# Altium project ART-Pi_STM32H750_COPY.PrjPcb (part 2 of 2)

## Sheet ART-Pi_Connector.SchDoc: Expansion_Conn
size A3; DocumentNumber: 10; Revision: V1.5; SheetNumber: 10; SheetTotal: 11; PageSetup: Record=PageOptions|CenterHorizontal=True|CenterVertical=True|PrintScale=1.01|XCorrection=1.00|YCorrection=1.00|PrintKind=0|BorderSize=5000000|LeftOffset=0|BottomOffset=0|Orientation=2|PaperLength=1000|PaperWidth=1000|Scale=100|PaperSource=7|PrintQuality=600|MediaType=1|DitherType=10|PrintScaleMode=1|PaperKind=A3(297x420mm)|PaperIndex=8
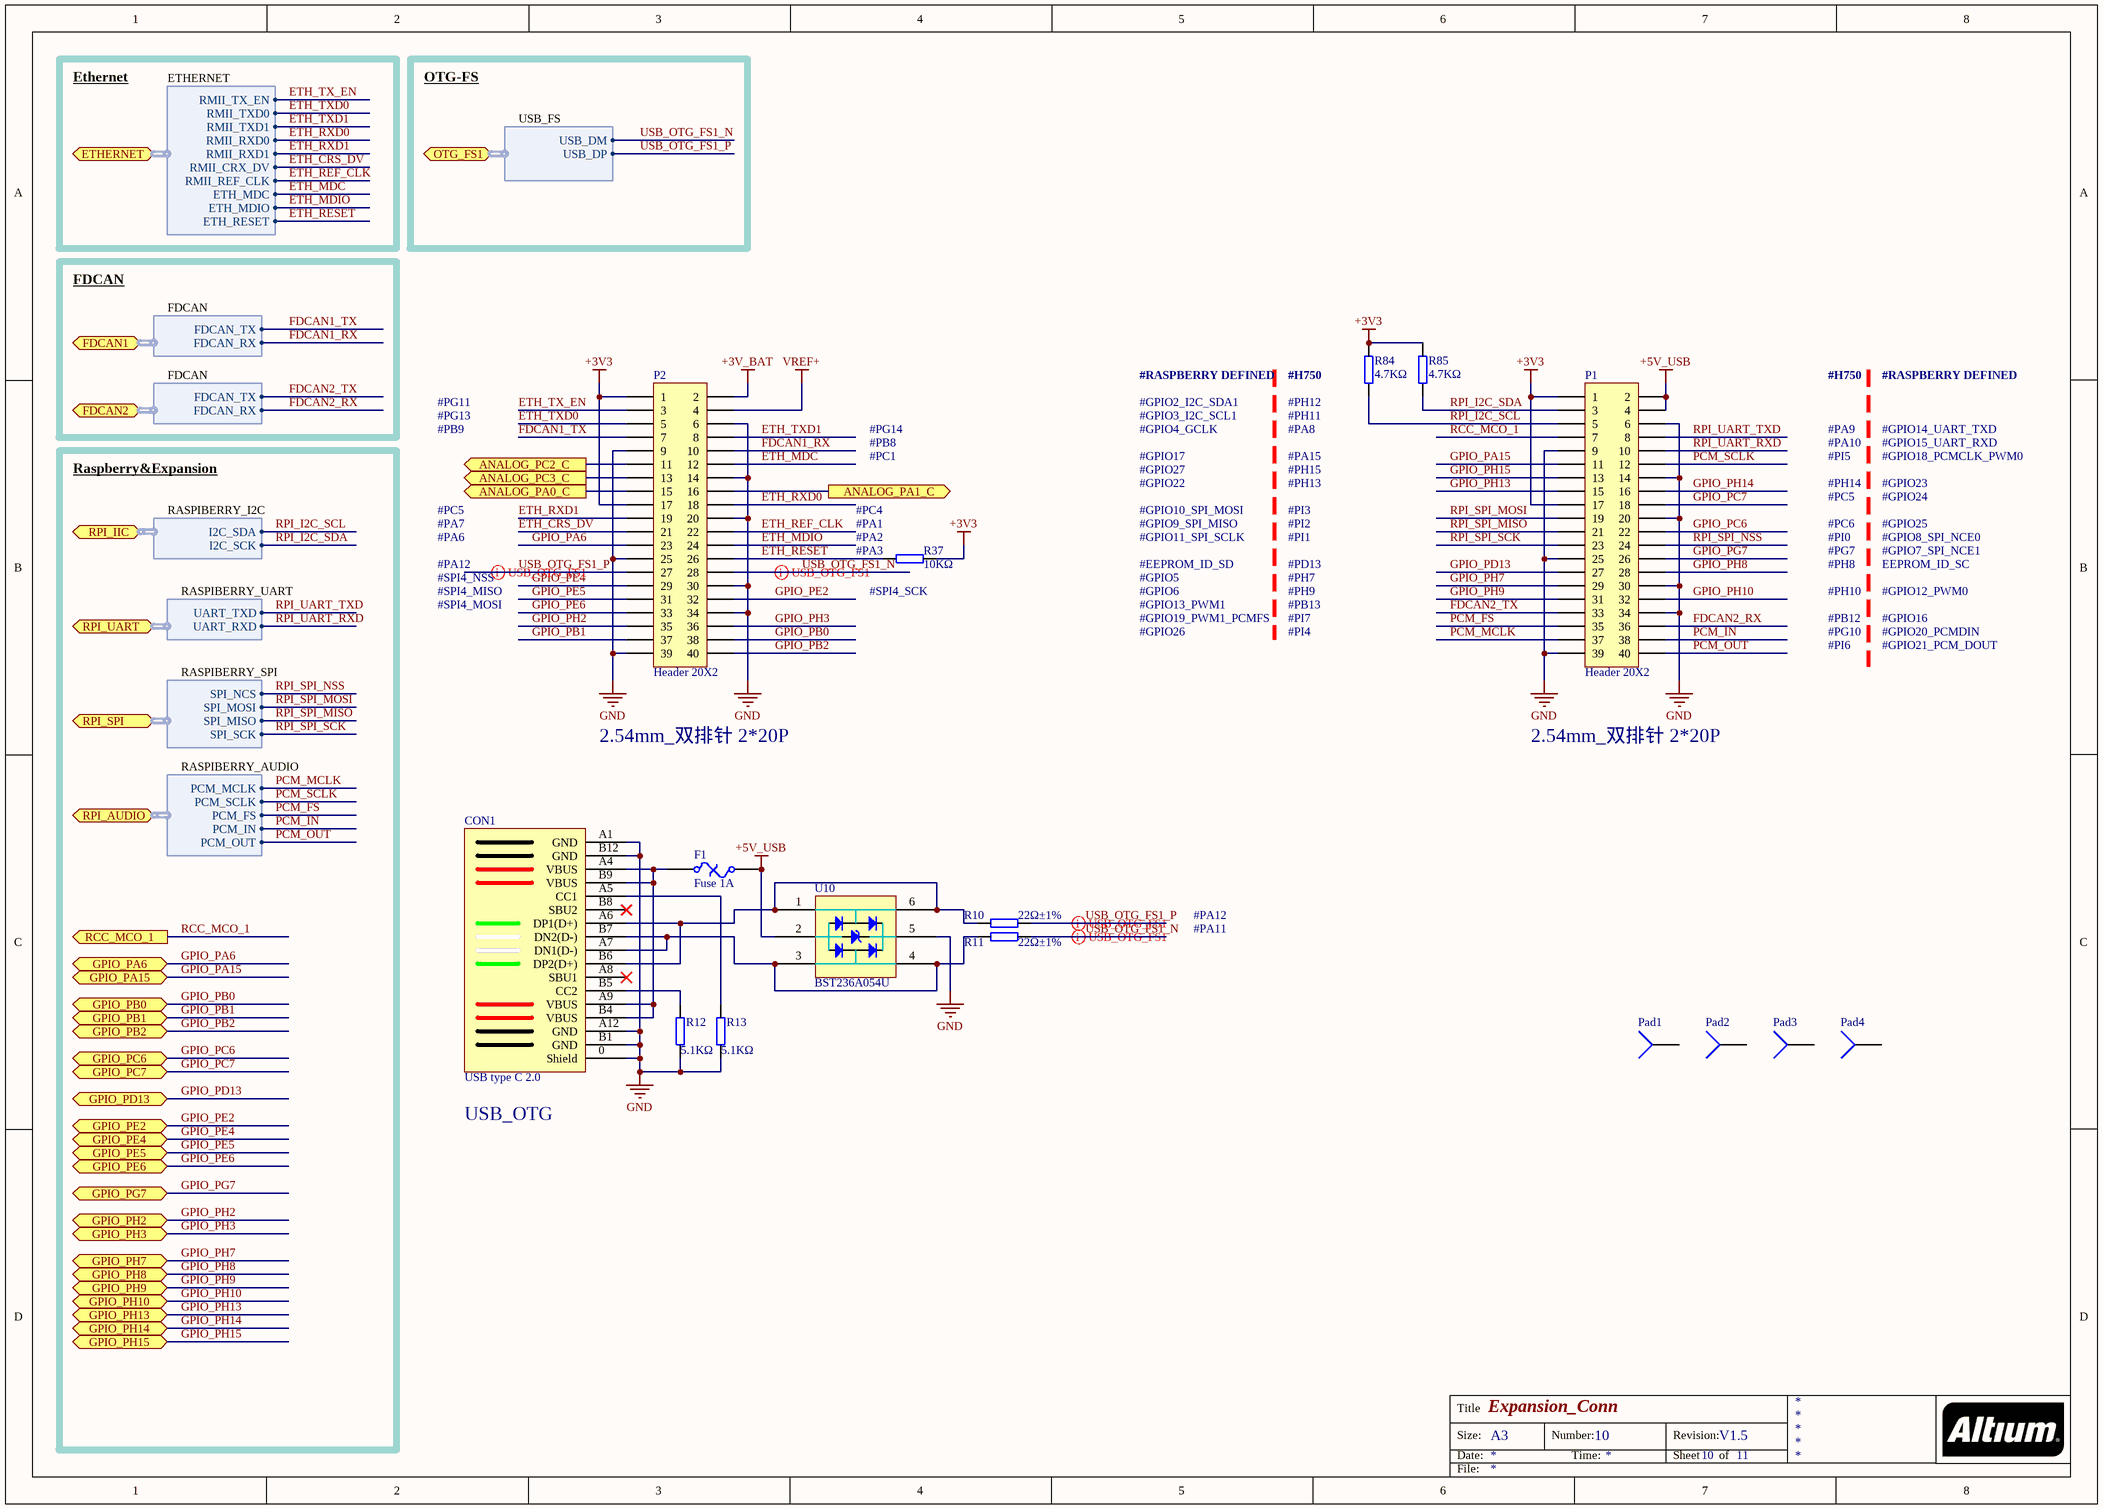
[diagram p8: ART-Pi_Connector.SchDoc]

### Parts
CON1  USB type C 2.0  [USB_C]
F1  Fuse 1A  [0805_R]
P1  Header 20X2  [HDR2X20]
P2  Header 20X2  [HDR2X20]
Pad1  Socket  [Pad-3mm]  (value not drawn)
Pad2  Socket  [Pad-3mm]  (value not drawn)
Pad3  Socket  [Pad-3mm]  (value not drawn)
Pad4  Socket  [Pad-3mm]  (value not drawn)
R10  22Ω±1%  [0402_R]
R11  22Ω±1%  [0402_R]
R12  5.1KΩ  [0402_R]
R13  5.1KΩ  [0402_R]
R37  10KΩ  [0402_R]
R84  4.7KΩ  [0402_R]
R85  4.7KΩ  [0402_R]
U10  BST236A054U  [SOT23_6]

### Ports
ANALOG_PA0_C (out), ANALOG_PA1_C (out), ANALOG_PC2_C (out), ANALOG_PC3_C (out), ETHERNET (harness Harness), FDCAN1 (harness Harness), FDCAN2 (harness Harness), GPIO_PA6 (bidir), GPIO_PA15 (bidir), GPIO_PB0 (bidir), GPIO_PB1 (bidir), GPIO_PB2 (bidir), GPIO_PC6 (bidir), GPIO_PC7 (bidir), GPIO_PD13 (bidir), GPIO_PE2 (bidir), GPIO_PE4 (bidir), GPIO_PE5 (bidir), GPIO_PE6 (bidir), GPIO_PG7 (bidir), GPIO_PH2 (bidir), GPIO_PH3 (bidir), GPIO_PH7 (bidir), GPIO_PH8 (bidir), GPIO_PH9 (bidir), GPIO_PH10 (bidir), GPIO_PH13 (bidir), GPIO_PH14 (bidir), GPIO_PH15 (bidir), OTG_FS1 (harness Harness), RCC_MCO_1 (out), RPI_AUDIO (harness Harness), RPI_IIC (harness Harness), RPI_SPI (harness Harness), RPI_UART (harness Harness)

### Harnesses
Harness: USB_DM, USB_DP
Harness: FDCAN_TX, FDCAN_RX
Harness: UART_TXD, UART_RXD
Harness: SPI_NCS, SPI_MOSI, SPI_MISO, SPI_SCK
Harness: PCM_MCLK, PCM_SCLK, PCM_FS, PCM_IN, PCM_OUT
Harness: RMII_TX_EN, RMII_TXD0, RMII_TXD1, RMII_RXD0, RMII_RXD1, RMII_CRX_DV, RMII_REF_CLK, ETH_MDC, ETH_MDIO, ETH_RESET
Harness: I2C_SCK, I2C_SDA

### Nets
+3V3: P1.1 P1.17 P2.1 P2.17 R37.1 R84.1 R85.1
+3V_BAT: P2.2
+5V_USB: F1.2 P1.2 P1.4 U10.2
GND: CON1.0(Shield) CON1.A1(GND) CON1.A12(GND) CON1.B1(GND) CON1.B12(GND) P1.6 P1.9 P1.14 P1.20 P1.25 P1.30 P1.34 P1.39 P2.6 P2.9 P2.14 P2.20 P2.25 P2.30 P2.34 P2.39 R12.2 R13.2 U10.5
VREF+: P2.4
ETH_CRS_DV: P2.21 ; port ETHERNET.RMII_CRX_DV
ETH_MDC: P2.12 ; port ETHERNET.ETH_MDC
ETH_MDIO: P2.24 ; port ETHERNET.ETH_MDIO
ETH_REF_CLK: P2.22 ; port ETHERNET.RMII_REF_CLK
ETH_RESET: P2.26 R37.2 ; port ETHERNET.ETH_RESET
ETH_RXD0: P2.18 ; port ETHERNET.RMII_RXD0
ETH_RXD1: P2.19 ; port ETHERNET.RMII_RXD1
ETH_TX_EN: P2.3 ; port ETHERNET.RMII_TX_EN
ETH_TXD0: P2.5 ; port ETHERNET.RMII_TXD0
ETH_TXD1: P2.8 ; port ETHERNET.RMII_TXD1
FDCAN1_RX: P2.10 ; port FDCAN1.FDCAN_RX
FDCAN1_TX: P2.7 ; port FDCAN1.FDCAN_TX
FDCAN2_RX: P1.36 ; port FDCAN2.FDCAN_RX
FDCAN2_TX: P1.33 ; port FDCAN2.FDCAN_TX
GPIO_PA6: P2.23 ; port GPIO_PA6
GPIO_PA15: P1.11 ; port GPIO_PA15
GPIO_PB0: P2.38 ; port GPIO_PB0
GPIO_PB1: P2.37 ; port GPIO_PB1
GPIO_PB2: P2.40 ; port GPIO_PB2
GPIO_PC6: P1.22 ; port GPIO_PC6
GPIO_PC7: P1.18 ; port GPIO_PC7
GPIO_PD13: P1.27 ; port GPIO_PD13
GPIO_PE2: P2.32 ; port GPIO_PE2
GPIO_PE4: P2.29 ; port GPIO_PE4
GPIO_PE5: P2.31 ; port GPIO_PE5
GPIO_PE6: P2.33 ; port GPIO_PE6
GPIO_PG7: P1.26 ; port GPIO_PG7
GPIO_PH2: P2.35 ; port GPIO_PH2
GPIO_PH3: P2.36 ; port GPIO_PH3
GPIO_PH7: P1.29 ; port GPIO_PH7
GPIO_PH8: P1.28 ; port GPIO_PH8
GPIO_PH9: P1.31 ; port GPIO_PH9
GPIO_PH10: P1.32 ; port GPIO_PH10
GPIO_PH13: P1.15 ; port GPIO_PH13  [project net GPIO_PH11]
GPIO_PH14: P1.16 ; port GPIO_PH14  [project net GPIO_PH12]
GPIO_PH15: P1.13 ; port GPIO_PH15
PA0_C: P2.15 ; port ANALOG_PA0_C
PA1_C: P2.16 ; port ANALOG_PA1_C
PC2_C: P2.11 ; port ANALOG_PC2_C
PC3_C: P2.13 ; port ANALOG_PC3_C
PCM_FS: P1.35 ; port RPI_AUDIO.PCM_FS
PCM_IN: P1.38 ; port RPI_AUDIO.PCM_IN
PCM_MCLK: P1.37 ; port RPI_AUDIO.PCM_MCLK
PCM_OUT: P1.40 ; port RPI_AUDIO.PCM_OUT
PCM_SCLK: P1.12 ; port RPI_AUDIO.PCM_SCLK
RCC_MCO_1: P1.7 ; port RCC_MCO_1
RPI_I2C_SCL: P1.5 R84.2 ; port RPI_IIC.I2C_SDA  [project net I2C4_SDA]
RPI_I2C_SDA: P1.3 R85.2 ; port RPI_IIC.I2C_SCK  [project net I2C4_SCL]
RPI_SPI_MISO: P1.21 ; port RPI_SPI.SPI_MISO
RPI_SPI_MOSI: P1.19 ; port RPI_SPI.SPI_MOSI
RPI_SPI_NSS: P1.24 ; port RPI_SPI.SPI_NCS
RPI_SPI_SCK: P1.23 ; port RPI_SPI.SPI_SCK
RPI_UART_RXD: P1.10 ; port RPI_UART.UART_RXD
RPI_UART_TXD: P1.8 ; port RPI_UART.UART_TXD
USB_OTG_FS1_N: P2.28 R11.2 ; port OTG_FS1.USB_DM
USB_OTG_FS1_P: P2.27 R10.2 ; port OTG_FS1.USB_DP
NetCON1_A4: CON1.A4(VBUS) CON1.A9(VBUS) CON1.B4(VBUS) CON1.B9(VBUS) F1.1
NetCON1_A5: CON1.A5(CC1) R13.1
NetCON1_A6: CON1.A6(DP1(D+)) CON1.B6(DP2(D+)) R10.1 U10.1 U10.6
NetCON1_A7: CON1.A7(DN1(D-)) CON1.B7(DN2(D-)) R11.1 U10.3 U10.4
NetCON1_B5: CON1.B5(CC2) R12.1

Not connected (* = marked no-connect by the designer): CON1 A8(SBU1)* B8(SBU2)*; Pad1 0; Pad2 0; Pad3 0; Pad4 0

### Layout directives
differential pair: USB_OTG_FS1_N, USB_OTG_FS1_P

### Notes on the sheet
- Ethernet
- ETHERNET
- OTG-FS
- USB_FS
- FDCAN
- #RASPBERRY DEFINED
- (near R84) #H750
- #H750
- #PG11
- #PG13
- #PB9
- #PG14
- #PB8
- #GPIO2_I2C_SDA1
- #GPIO3_I2C_SCL1
- #GPIO4_GCLK
- (near R84) #PH12
- #PH11
- #PA8
- #PA9
- #PA10
- #GPIO14_UART_TXD
- #GPIO15_UART_RXD
- Raspberry&Expansion
- RASPIBERRY_I2C
- #PC5
- (near R37) #PC4
- #PC1
- #GPIO17
- #GPIO27
- #GPIO22
- #GPIO10_SPI_MOSI
- #PA15
- #PH15
- #PH13
- #PI3
- #PI5
- #PH14
- #GPIO18_PCMCLK_PWM0
- #GPIO23
- #GPIO24
- #PA7
- #PA6
- #PA12
- #SPI4_NSS
- (near R37) #PA1
- (near R37) #PA2
- (near R37) #PA3
- #GPIO9_SPI_MISO
- #GPIO11_SPI_SCLK
- #EEPROM_ID_SD
- #GPIO5
- #PI2
- #PI1
- #PD13
- #PH7
- #PC6
- #PI0
- #PG7
- #PH8
- #GPIO25
- #GPIO8_SPI_NCE0
- #GPIO7_SPI_NCE1
- EEPROM_ID_SC
- RASPIBERRY_UART
- #SPI4_MISO
- #SPI4_MOSI
- (near R37) #SPI4_SCK
- #GPIO6
- #GPIO13_PWM1
- #GPIO19_PWM1_PCMFS
- #GPIO26
- #PH9
- #PB13
- #PI7
- #PI4
- #PH10
- #PB12
- #PG10
- #PI6
- #GPIO12_PWM0
- #GPIO16
- #GPIO20_PCMDIN
- #GPIO21_PCM_DOUT
- RASPIBERRY_SPI
- RASPIBERRY_AUDIO
- 2.54mm_双排针 2*20P
- #PA11
- USB_OTG
- Title
- Size:
- Date:
- A3
- Number:
- Time:
- Revision:
- Sheet
- of
- File:

### Library data of the parts
CON1 = USB type C
F1 = Fuse Thermal: Thermal Fuse; Published: 24-Mar-1999; LatestRevisionDate: 17-Jul-2002; LatestRevisionNote: Re-released for DXP Platform.; PackageReference: PIN-W2/E2.8; Publisher: Altium Limited; PackageDescription: Thru-Hole; 2 Leads
P1 P2 = Header 20X2: Header, 20-Pin, Dual row; LatestRevisionDate: 17-Jul-2002; LatestRevisionNote: Re-released for DXP Platform.; Publisher: Altium Limited
R10-R13 R37 R84 R85 = Res: Resister
Pad1-Pad4 = Socket: LatestRevisionDate: 17-Jul-2002; LatestRevisionNote: Re-released for DXP Platform.; Publisher: Altium Limited

## Nets that join several sheets
+3V3: ART-Pi_Power (55 pins), ART-Pi_SDRAM (14 pins), ART-Pi_Memory (18 pins), ART-Pi_LCD&Camera (R51.1 R81.1 R82.1 R83.1), ART-Pi_H750_Peripherals (9 pins), ART-Pi_F103_AP6212 (28 pins), ART-Pi_Connector (7 pins)
+3V_BAT: ART-Pi_Power (D1.1), ART-Pi_Connector (P2.2)
+5V_USB: ART-Pi_Power (5 pins), ART-Pi_LCD&Camera (C43.2 C44.2 CN1.1 CN1.2), ART-Pi_F103_AP6212 (F2.2 R40.1 U9.2), ART-Pi_Connector (F1.2 P1.2 P1.4 U10.2)
GND: ART-Pi_Power (87 pins), ART-Pi_SDRAM (14 pins), ART-Pi_Memory (16 pins), ART-Pi_LCD&Camera (7 pins), ART-Pi_H750_Peripherals (11 pins), ART-Pi_F103_AP6212 (46 pins), ART-Pi_Connector (24 pins)
VREF+: ART-Pi_Power (C41.2 C42.2 R9.1 U1.M1), ART-Pi_Connector (P2.4)
BT_HOST_WAKE: ART-Pi_H750_Peripherals (U1.L2), ART-Pi_F103_AP6212 (R62.2 U8.7)
BT_RST_N: ART-Pi_H750_Peripherals (U1.F4), ART-Pi_F103_AP6212 (R61.2 U8.34)
BT_UART_CTS_N: ART-Pi_H750_Peripherals (U1.R15), ART-Pi_F103_AP6212 (P4.1 R64.2 U8.44)
BT_UART_RTS_N: ART-Pi_H750_Peripherals (U1.R16), ART-Pi_F103_AP6212 (P4.3 R63.2 U8.41)
BT_UART_RXD: ART-Pi_H750_Peripherals (U1.P12), ART-Pi_F103_AP6212 (P4.4 U8.43)
BT_UART_TXD: ART-Pi_H750_Peripherals (U1.P11), ART-Pi_F103_AP6212 (P4.2 U8.42)
BT_WAKE: ART-Pi_H750_Peripherals (U1.F3), ART-Pi_F103_AP6212 (R60.2 U8.6)
ETH_CRS_DV: ART-Pi_H750_Peripherals (U1.R5), ART-Pi_Connector (P2.21)
ETH_MDC: ART-Pi_H750_Peripherals (U1.M2), ART-Pi_Connector (P2.12)
ETH_MDIO: ART-Pi_H750_Peripherals (U1.N3), ART-Pi_Connector (P2.24)
ETH_REF_CLK: ART-Pi_H750_Peripherals (U1.N4), ART-Pi_Connector (P2.22)
ETH_RESET: ART-Pi_H750_Peripherals (U1.U2), ART-Pi_Connector (P2.26 R37.2)
ETH_RXD0: ART-Pi_H750_Peripherals (U1.T4), ART-Pi_Connector (P2.18)
ETH_RXD1: ART-Pi_H750_Peripherals (U1.U4), ART-Pi_Connector (P2.19)
ETH_TX_EN: ART-Pi_H750_Peripherals (U1.B9), ART-Pi_Connector (P2.3)
ETH_TXD0: ART-Pi_H750_Peripherals (U1.D9), ART-Pi_Connector (P2.5)
ETH_TXD1: ART-Pi_H750_Peripherals (U1.D8), ART-Pi_Connector (P2.8)
FDCAN1_RX: ART-Pi_H750_Peripherals (U1.D5), ART-Pi_Connector (P2.10)
FDCAN1_TX: ART-Pi_H750_Peripherals (U1.D4), ART-Pi_Connector (P2.7)
FDCAN2_RX: ART-Pi_H750_Peripherals (U1.T14), ART-Pi_Connector (P1.36)
FDCAN2_TX: ART-Pi_H750_Peripherals (U1.U14), ART-Pi_Connector (P1.33)
FLASH_SPI_MISO: ART-Pi_Memory (U2.2), ART-Pi_H750_Peripherals (U1.A10)
FLASH_SPI_MOSI: ART-Pi_Memory (U2.5), ART-Pi_H750_Peripherals (U1.A5)
FLASH_SPI_NCS: ART-Pi_Memory (R1.2 U2.1), ART-Pi_H750_Peripherals (U1.U3)
FLASH_SPI_SCK: ART-Pi_Memory (R3.2), ART-Pi_H750_Peripherals (U1.T3)
FMC_A0: ART-Pi_SDRAM (U5.23), ART-Pi_H750_Peripherals (U1.G4)
FMC_A1: ART-Pi_SDRAM (U5.24), ART-Pi_H750_Peripherals (U1.G3)
FMC_A2: ART-Pi_SDRAM (U5.25), ART-Pi_H750_Peripherals (U1.G1)
FMC_A3: ART-Pi_SDRAM (U5.26), ART-Pi_H750_Peripherals (U1.H4)
FMC_A4: ART-Pi_SDRAM (U5.29), ART-Pi_H750_Peripherals (U1.J5)
FMC_A5: ART-Pi_SDRAM (U5.30), ART-Pi_H750_Peripherals (U1.J4)
FMC_A6: ART-Pi_SDRAM (U5.31), ART-Pi_H750_Peripherals (U1.R7)
FMC_A7: ART-Pi_SDRAM (U5.32), ART-Pi_H750_Peripherals (U1.P7)
FMC_A8: ART-Pi_SDRAM (U5.33), ART-Pi_H750_Peripherals (U1.P8)
FMC_A9: ART-Pi_SDRAM (U5.34), ART-Pi_H750_Peripherals (U1.R9)
FMC_A10: ART-Pi_SDRAM (U5.22), ART-Pi_H750_Peripherals (U1.T8)
FMC_A11: ART-Pi_SDRAM (U5.35), ART-Pi_H750_Peripherals (U1.U8)
FMC_A12: ART-Pi_SDRAM (U5.36), ART-Pi_H750_Peripherals (U1.H16)
FMC_BA0: ART-Pi_SDRAM (U5.20), ART-Pi_H750_Peripherals (U1.H14)
FMC_BA1: ART-Pi_SDRAM (U5.21), ART-Pi_H750_Peripherals (U1.G14)
FMC_D0: ART-Pi_SDRAM (U5.2), ART-Pi_H750_Peripherals (U1.P16)
FMC_D1: ART-Pi_SDRAM (U5.4), ART-Pi_H750_Peripherals (U1.P15)
FMC_D2: ART-Pi_SDRAM (U5.5), ART-Pi_H750_Peripherals (U1.D13)
FMC_D3: ART-Pi_SDRAM (U5.7), ART-Pi_H750_Peripherals (U1.E12)
FMC_D4: ART-Pi_SDRAM (U5.8), ART-Pi_H750_Peripherals (U1.U9)
FMC_D5: ART-Pi_SDRAM (U5.10), ART-Pi_H750_Peripherals (U1.T9)
FMC_D6: ART-Pi_SDRAM (U5.11), ART-Pi_H750_Peripherals (U1.P9)
FMC_D7: ART-Pi_SDRAM (U5.13), ART-Pi_H750_Peripherals (U1.N9)
FMC_D8: ART-Pi_SDRAM (U5.42), ART-Pi_H750_Peripherals (U1.P10)
FMC_D9: ART-Pi_SDRAM (U5.44), ART-Pi_H750_Peripherals (U1.R10)
FMC_D10: ART-Pi_SDRAM (U5.45), ART-Pi_H750_Peripherals (U1.T10)
FMC_D11: ART-Pi_SDRAM (U5.47), ART-Pi_H750_Peripherals (U1.U10)
FMC_D12: ART-Pi_SDRAM (U5.48), ART-Pi_H750_Peripherals (U1.R11)
FMC_D13: ART-Pi_SDRAM (U5.50), ART-Pi_H750_Peripherals (U1.U16)
FMC_D14: ART-Pi_SDRAM (U5.51), ART-Pi_H750_Peripherals (U1.T17)
FMC_D15: ART-Pi_SDRAM (U5.53), ART-Pi_H750_Peripherals (U1.T16)
FMC_NBL0: ART-Pi_SDRAM (U5.15), ART-Pi_H750_Peripherals (U1.C4)
FMC_NBL1: ART-Pi_SDRAM (U5.39), ART-Pi_H750_Peripherals (U1.B4)
FMC_SDCKE0: ART-Pi_SDRAM (U5.37), ART-Pi_H750_Peripherals (U1.M4)
FMC_SDCLK: ART-Pi_SDRAM (U5.38), ART-Pi_H750_Peripherals (U1.F15)
FMC_SDNCAS: ART-Pi_SDRAM (U5.17), ART-Pi_H750_Peripherals (U1.D6)
FMC_SDNE0: ART-Pi_SDRAM (U5.19), ART-Pi_H750_Peripherals (U1.M3)
FMC_SDNRAS: ART-Pi_SDRAM (U5.18), ART-Pi_H750_Peripherals (U1.T7)
FMC_SDNWE: ART-Pi_SDRAM (U5.16), ART-Pi_H750_Peripherals (U1.P4)
GPIO_CARD_DETECT: ART-Pi_Memory (R80.2), ART-Pi_H750_Peripherals (U1.A11)
GPIO_LCD_BL: ART-Pi_LCD&Camera (CN1.34), ART-Pi_H750_Peripherals (U1.A12)
GPIO_PA6: ART-Pi_H750_Peripherals (U1.R3), ART-Pi_Connector (P2.23)
GPIO_PA15: ART-Pi_H750_Peripherals (U1.A14), ART-Pi_Connector (P1.11)
GPIO_PB0: ART-Pi_H750_Peripherals (U1.U5), ART-Pi_Connector (P2.38)
GPIO_PB1: ART-Pi_H750_Peripherals (U1.T5), ART-Pi_Connector (P2.37)
GPIO_PB2: ART-Pi_H750_Peripherals (U1.R6), ART-Pi_Connector (P2.40)
GPIO_PC6: ART-Pi_H750_Peripherals (U1.F14), ART-Pi_Connector (P1.22)
GPIO_PC7: ART-Pi_H750_Peripherals (U1.F13), ART-Pi_Connector (P1.18)
GPIO_PD13: ART-Pi_H750_Peripherals (U1.R17), ART-Pi_Connector (P1.27)
GPIO_PE2: ART-Pi_H750_Peripherals (U1.C3), ART-Pi_Connector (P2.32)
GPIO_PE4: ART-Pi_H750_Peripherals (U1.D2), ART-Pi_Connector (P2.29)
GPIO_PE5: ART-Pi_H750_Peripherals (U1.D1), ART-Pi_Connector (P2.31)
GPIO_PE6: ART-Pi_H750_Peripherals (U1.E5), ART-Pi_Connector (P2.33)
GPIO_PG7: ART-Pi_H750_Peripherals (U1.F16), ART-Pi_Connector (P1.26)
GPIO_PH2: ART-Pi_H750_Peripherals (U1.N2), ART-Pi_Connector (P2.35)
GPIO_PH3: ART-Pi_H750_Peripherals (U1.P2), ART-Pi_Connector (P2.36)
GPIO_PH7: ART-Pi_H750_Peripherals (U1.U13), ART-Pi_Connector (P1.29)
GPIO_PH8: ART-Pi_H750_Peripherals (U1.T13), ART-Pi_Connector (P1.28)
GPIO_PH9: ART-Pi_H750_Peripherals (U1.R13), ART-Pi_Connector (P1.31)
GPIO_PH10: ART-Pi_H750_Peripherals (U1.P13), ART-Pi_Connector (P1.32)
GPIO_PH11: ART-Pi_H750_Peripherals (U1.D16), ART-Pi_Connector (P1.15)
GPIO_PH12: ART-Pi_H750_Peripherals (U1.B17), ART-Pi_Connector (P1.16)
GPIO_PH15: ART-Pi_H750_Peripherals (U1.B16), ART-Pi_Connector (P1.13)
GPIO_WIFI_HOST_WAKE: ART-Pi_H750_Peripherals (U1.D3), ART-Pi_F103_AP6212 (U8.13)
GPIO_WIFI_REG_ON: ART-Pi_H750_Peripherals (U1.E3), ART-Pi_F103_AP6212 (U8.12)
I2C4_SCL: ART-Pi_H750_Peripherals (U1.P14), ART-Pi_Connector (P1.3 R85.2)
I2C4_SDA: ART-Pi_H750_Peripherals (U1.R14), ART-Pi_Connector (P1.5 R84.2)
LCD_B0: ART-Pi_LCD&Camera (CN1.21), ART-Pi_H750_Peripherals (U1.D11)
LCD_B1: ART-Pi_LCD&Camera (CN1.22), ART-Pi_H750_Peripherals (U1.E10)
LCD_B2: ART-Pi_LCD&Camera (CN1.23), ART-Pi_H750_Peripherals (U1.D10)
LCD_B3: ART-Pi_LCD&Camera (CN1.24), ART-Pi_H750_Peripherals (U1.B10)
LCD_B4: ART-Pi_LCD&Camera (CN1.25), ART-Pi_H750_Peripherals (U1.C8)
LCD_B5: ART-Pi_LCD&Camera (CN1.26), ART-Pi_H750_Peripherals (U1.B8)
LCD_B6: ART-Pi_LCD&Camera (CN1.27), ART-Pi_H750_Peripherals (U1.A8)
LCD_B7: ART-Pi_LCD&Camera (CN1.28), ART-Pi_H750_Peripherals (U1.C7)
LCD_CLK: ART-Pi_LCD&Camera (CN1.30), ART-Pi_H750_Peripherals (U1.H3)
LCD_DE: ART-Pi_LCD&Camera (CN1.33), ART-Pi_H750_Peripherals (U1.D7)
LCD_G0: ART-Pi_LCD&Camera (CN1.12), ART-Pi_H750_Peripherals (U1.N14)
LCD_G1: ART-Pi_LCD&Camera (CN1.13), ART-Pi_H750_Peripherals (U1.N13)
LCD_G2: ART-Pi_LCD&Camera (CN1.14), ART-Pi_H750_Peripherals (U1.M14)
LCD_G3: ART-Pi_LCD&Camera (CN1.15), ART-Pi_H750_Peripherals (U1.L14)
LCD_G4: ART-Pi_LCD&Camera (CN1.16), ART-Pi_H750_Peripherals (U1.K14)
LCD_G5: ART-Pi_LCD&Camera (CN1.17), ART-Pi_H750_Peripherals (U1.J14)
LCD_G6: ART-Pi_LCD&Camera (CN1.18), ART-Pi_H750_Peripherals (U1.J15)
LCD_G7: ART-Pi_LCD&Camera (CN1.19), ART-Pi_H750_Peripherals (U1.H17)
LCD_HSYNC: ART-Pi_LCD&Camera (CN1.31), ART-Pi_H750_Peripherals (U1.H1)
LCD_R0: ART-Pi_LCD&Camera (CN1.3), ART-Pi_H750_Peripherals (U1.P5)
LCD_R1: ART-Pi_LCD&Camera (CN1.4), ART-Pi_H750_Peripherals (U1.N6)
LCD_R2: ART-Pi_LCD&Camera (CN1.5), ART-Pi_H750_Peripherals (U1.P6)
LCD_R3: ART-Pi_LCD&Camera (CN1.6), ART-Pi_H750_Peripherals (U1.T6)
LCD_R4: ART-Pi_LCD&Camera (CN1.7), ART-Pi_H750_Peripherals (U1.U6)
LCD_R5: ART-Pi_LCD&Camera (CN1.8), ART-Pi_H750_Peripherals (U1.U7)
LCD_R6: ART-Pi_LCD&Camera (CN1.9), ART-Pi_H750_Peripherals (U1.R12)
LCD_R7: ART-Pi_LCD&Camera (CN1.10), ART-Pi_H750_Peripherals (U1.N15)
LCD_VSYNC: ART-Pi_LCD&Camera (CN1.32), ART-Pi_H750_Peripherals (U1.H2)
NRST: ART-Pi_H750_Peripherals (K1.1), ART-Pi_F103_AP6212 (P5.3 U7.18)
PA0_C: ART-Pi_H750_Peripherals (U1.T1), ART-Pi_Connector (P2.15)
PA1_C: ART-Pi_H750_Peripherals (U1.T2), ART-Pi_Connector (P2.16)
PC2_C: ART-Pi_H750_Peripherals (U1.R1), ART-Pi_Connector (P2.11)
PC3_C: ART-Pi_H750_Peripherals (U1.R2), ART-Pi_Connector (P2.13)
PCM_FS: ART-Pi_H750_Peripherals (U1.B3), ART-Pi_Connector (P1.35)
PCM_IN: ART-Pi_H750_Peripherals (U1.A9), ART-Pi_Connector (P1.38)
PCM_MCLK: ART-Pi_H750_Peripherals (U1.A4), ART-Pi_Connector (P1.37)
PCM_OUT: ART-Pi_H750_Peripherals (U1.A2), ART-Pi_Connector (P1.40)
PCM_SCLK: ART-Pi_H750_Peripherals (U1.A3), ART-Pi_Connector (P1.12)
QSPI_BK1_~{CE}: ART-Pi_Memory (R2.2 U3.1), ART-Pi_H750_Peripherals (U1.G15)
QSPI_BK1_D0: ART-Pi_Memory (U3.5), ART-Pi_H750_Peripherals (U1.K4)
QSPI_BK1_D1: ART-Pi_Memory (U3.2), ART-Pi_H750_Peripherals (U1.L4)
QSPI_BK1_D2: ART-Pi_Memory (U3.3), ART-Pi_H750_Peripherals (U1.K3)
QSPI_BK1_D3: ART-Pi_Memory (U3.7), ART-Pi_H750_Peripherals (U1.K2)
QSPI_CLK: ART-Pi_Memory (R4.2), ART-Pi_H750_Peripherals (U1.L3)
RCC_MCO_1: ART-Pi_H750_Peripherals (U1.E15), ART-Pi_Connector (P1.7)
RPI_SPI_MISO: ART-Pi_H750_Peripherals (U1.B15), ART-Pi_Connector (P1.21)
RPI_SPI_MOSI: ART-Pi_H750_Peripherals (U1.C14), ART-Pi_Connector (P1.19)
RPI_SPI_NSS: ART-Pi_H750_Peripherals (U1.A16), ART-Pi_Connector (P1.24)
RPI_SPI_SCK: ART-Pi_H750_Peripherals (U1.A15), ART-Pi_Connector (P1.23)
RPI_UART_RXD: ART-Pi_H750_Peripherals (U1.D14), ART-Pi_Connector (P1.10)
RPI_UART_TXD: ART-Pi_H750_Peripherals (U1.D15), ART-Pi_Connector (P1.8)
SD_CLK: ART-Pi_Memory (R77.2), ART-Pi_H750_Peripherals (U1.C12)
SD_CMD: ART-Pi_Memory (R76.2), ART-Pi_H750_Peripherals (U1.D12)
SD_DAT0: ART-Pi_Memory (R78.2), ART-Pi_H750_Peripherals (U1.E13)
SD_DAT1: ART-Pi_Memory (R79.2), ART-Pi_H750_Peripherals (U1.E14)
SD_DAT2: ART-Pi_Memory (R74.2), ART-Pi_H750_Peripherals (U1.A13)
SD_DAT3: ART-Pi_Memory (R75.2), ART-Pi_H750_Peripherals (U1.B13)
SDMMC2_CK: ART-Pi_H750_Peripherals (U1.B11), ART-Pi_F103_AP6212 (R39.1)
SDMMC2_CMD: ART-Pi_H750_Peripherals (U1.C11), ART-Pi_F103_AP6212 (R30.2 U8.16)
SDMMC2_D0: ART-Pi_H750_Peripherals (U1.U15), ART-Pi_F103_AP6212 (R8.2 U8.18)
SDMMC2_D1: ART-Pi_H750_Peripherals (U1.T15), ART-Pi_F103_AP6212 (R25.2 U8.19)
SDMMC2_D2: ART-Pi_H750_Peripherals (U1.C6), ART-Pi_F103_AP6212 (R26.2 U8.14)
SDMMC2_D3: ART-Pi_H750_Peripherals (U1.B7), ART-Pi_F103_AP6212 (R29.2 U8.15)
USB_OTG_FS1_N: ART-Pi_H750_Peripherals (U1.E17), ART-Pi_Connector (P2.28 R11.2)
USB_OTG_FS1_P: ART-Pi_H750_Peripherals (U1.E16), ART-Pi_Connector (P2.27 R10.2)